# Altium project PP_2_0.PrjPcb
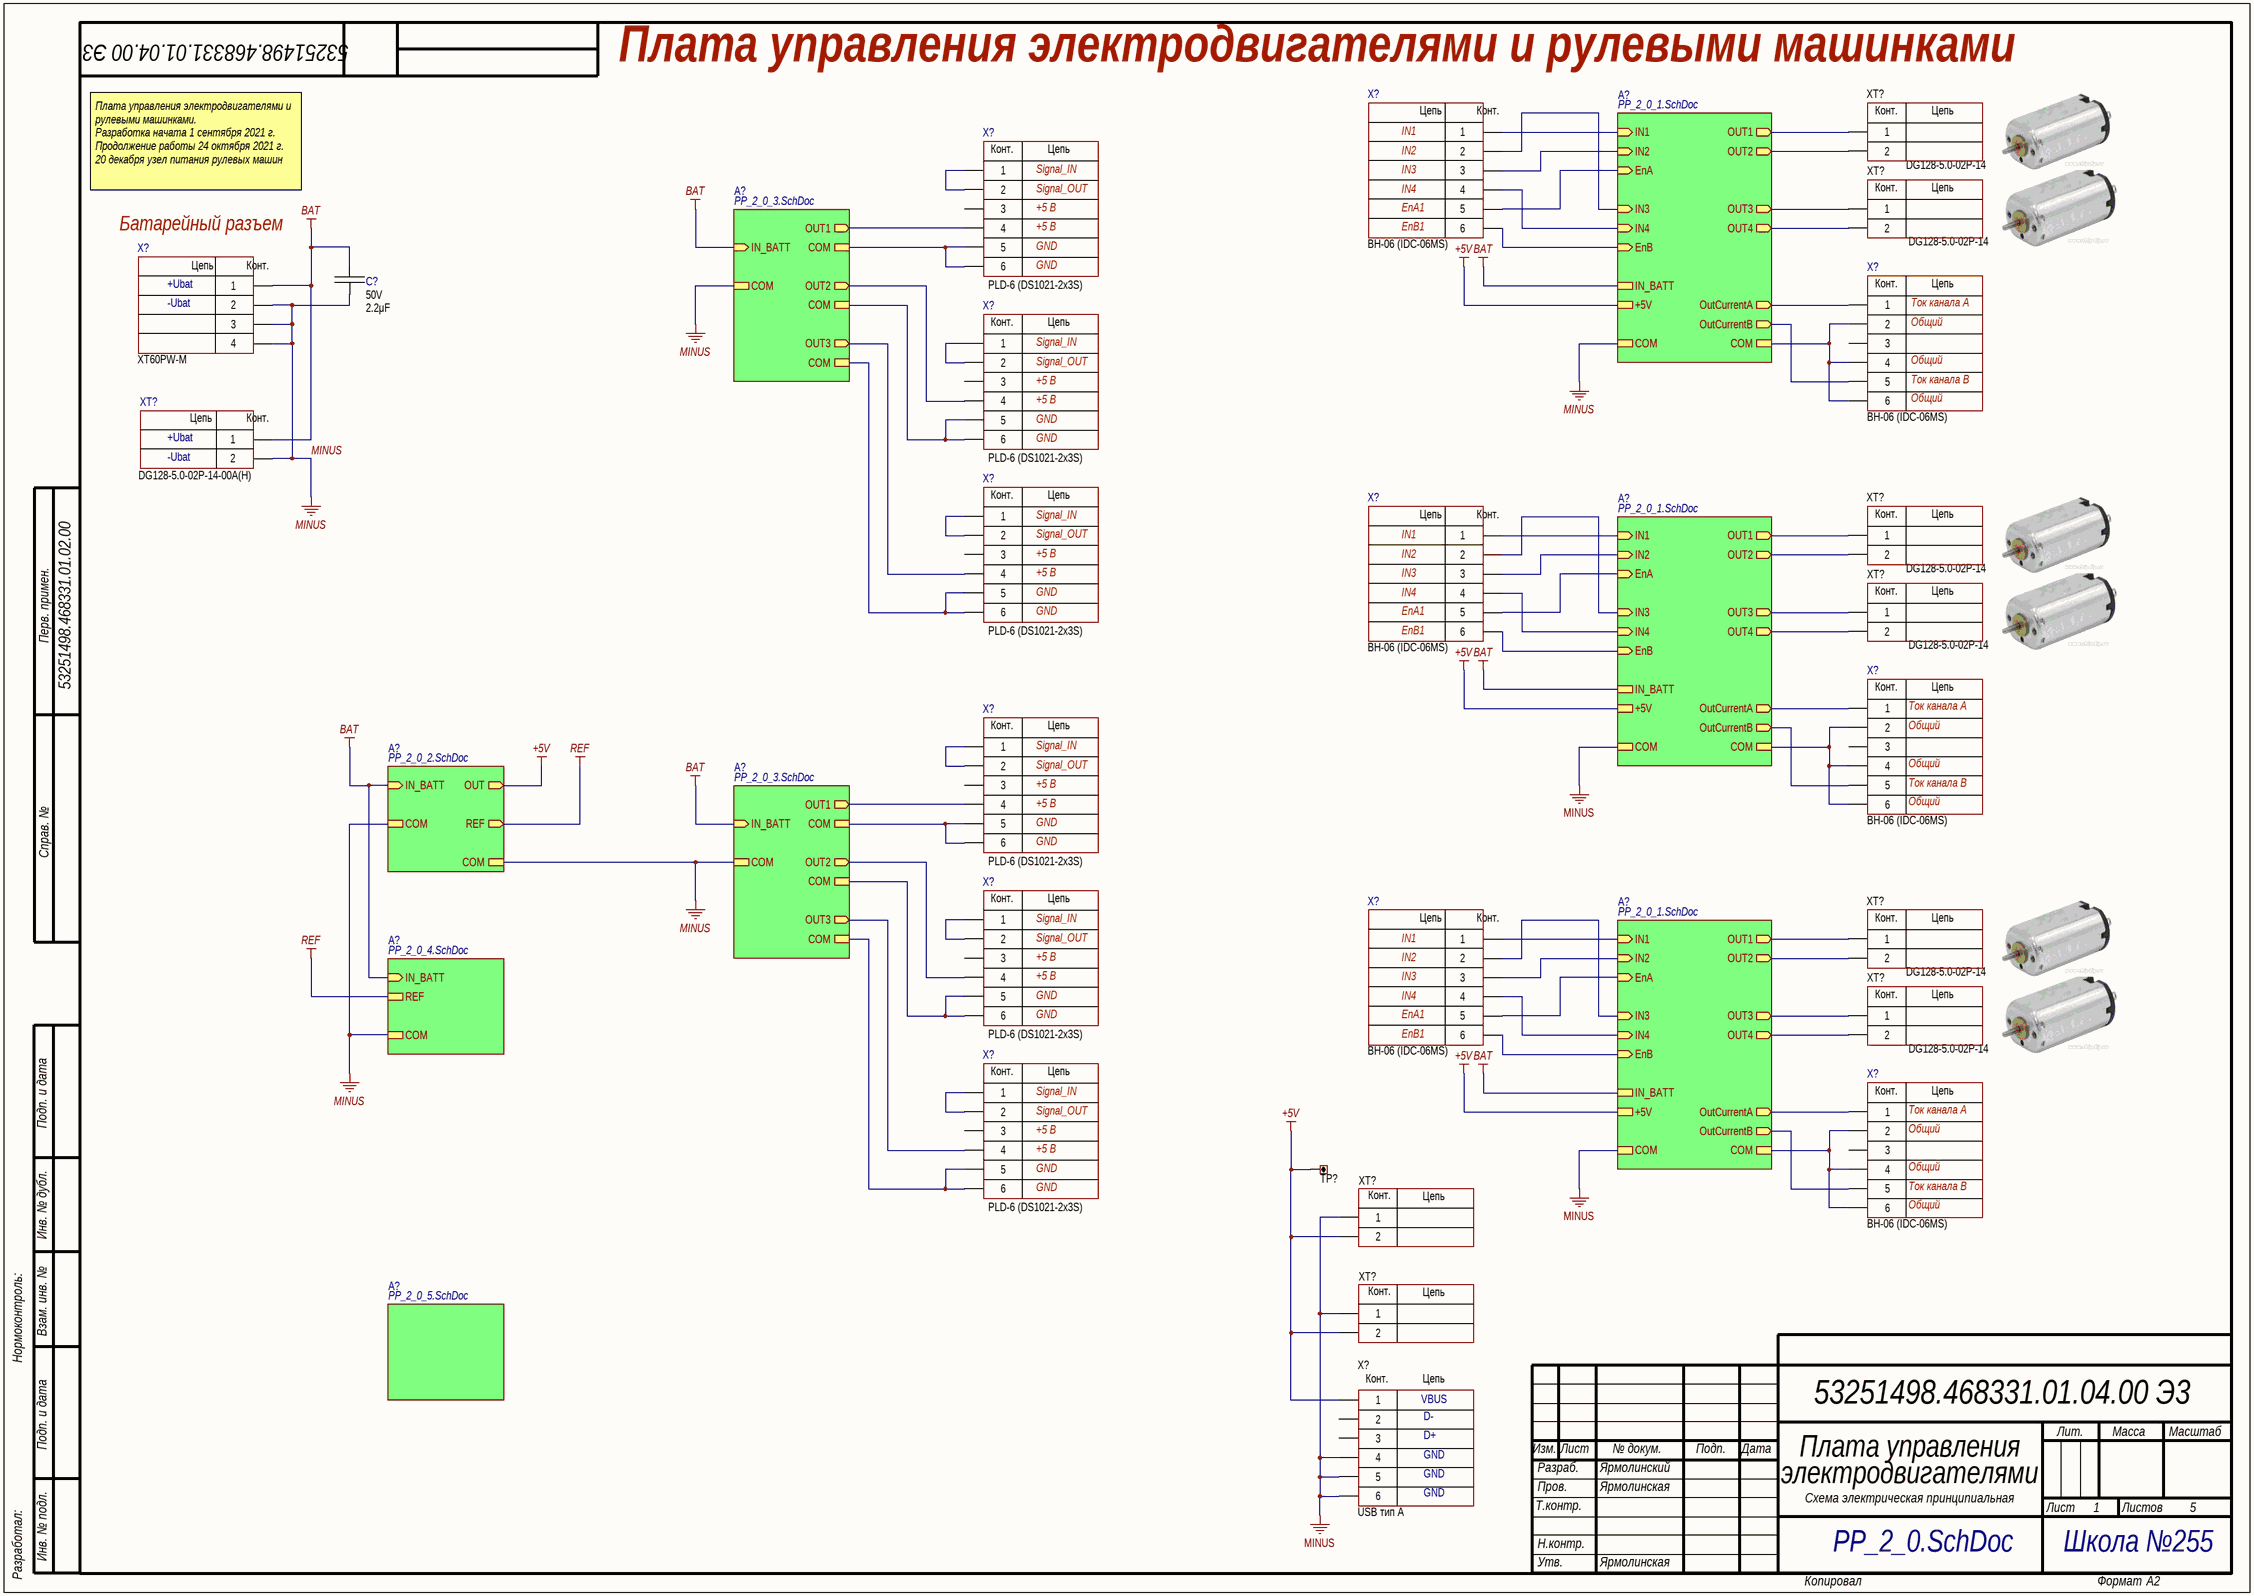
[diagram p0: PP_2_0.SchDoc]
6 sheets, 216 parts. Net scope: strictly hierarchical (ports join the sheet entries above them; power ports are local).
Sheets:
  PP_2_0.SchDoc
    A? = PP_2_0_1.SchDoc
    A? = PP_2_0_2.SchDoc
    A? = PP_2_0_3.SchDoc
    A? = PP_2_0_4.SchDoc
    A? = PP_2_0_3.SchDoc
    A? = PP_2_0_1.SchDoc
    A? = PP_2_0_1.SchDoc
    A? = PP_2_0_5.SchDoc

## Sheet PP_2_0.SchDoc: Плата управления
size 594 x 420 mm; ApprovedBy: Ярмолинская; CheckedBy: Ярмолинская; DrawnBy: Ярмолинский; Organization: Школа №255; DocumentNumber: 53251498.468331.01.04.00 Э3; SheetNumber: 1; SheetTotal: 5; Title1str: электродвигателями; DocumentType: Схема электрическая принципиальная; Format: A2; ImagePath: 53251498.468331.01.02.00

### Parts
(Parts that share a designator on the sheet are numbered #1, #2 ... from top to bottom, then left to right.)
C?#1  value 2.2μF  Voltage: 50V  [CAP: 1206, Thru-Hole]
TP?#1  (no value)  [CON: 5000 (Keystone)]
X?#1  CommentText: BH-06 (IDC-06MS)  [CON: IDC-6MS]
X?#2  CommentText: PLD-6 (DS1021-2x3S)  [CON: PLD-6]
X?#3  CommentText: XT60PW-M  [CON: XT60PW-M]
X?#4  CommentText: BH-06 (IDC-06MS)  [CON: IDC-6MS]
X?#5  CommentText: PLD-6 (DS1021-2x3S)  [CON: PLD-6]
X?#6  CommentText: PLD-6 (DS1021-2x3S)  [CON: PLD-6]
X?#7  CommentText: BH-06 (IDC-06MS)  [CON: IDC-6MS]
X?#8  CommentText: BH-06 (IDC-06MS)  [CON: IDC-6MS]
X?#9  CommentText: PLD-6 (DS1021-2x3S)  [CON: PLD-6]
X?#10  CommentText: PLD-6 (DS1021-2x3S)  [CON: PLD-6]
X?#11  CommentText: BH-06 (IDC-06MS)  [CON: IDC-6MS]
X?#12  CommentText: PLD-6 (DS1021-2x3S)  [CON: PLD-6]
X?#13  CommentText: BH-06 (IDC-06MS)  [CON: IDC-6MS]
X?#14  CommentText: USB тип А  [CON: 787761]
XT?#1  CommentText: DG128-5.0-02P-14  [CON: DG128-5.0-02P]
XT?#2  CommentText: DG128-5.0-02P-14  [CON: DG128-5.0-02P]
XT?#3  CommentText: DG128-5.0-02P-14-00A(H)  [CON: DG128-5.0-02P]
XT?#4  CommentText: DG128-5.0-02P-14  [CON: DG128-5.0-02P]
XT?#5  CommentText: DG128-5.0-02P-14  [CON: DG128-5.0-02P]
XT?#6  CommentText: DG128-5.0-02P-14  [CON: DG128-5.0-02P]
XT?#7  CommentText: DG128-5.0-02P-14  [CON: DG128-5.0-02P]
XT?#8  (no value)  [CON: DG128-5.0-02P]
XT?#9  (no value)  [CON: DG128-5.0-02P]

### Sub-sheets
A? = PP_2_0_1.SchDoc: OutCurrentB (out), IN3 (in), IN4 (in), EnB (in), OUT3 (out), OUT2 (out), OUT1 (out), OUT4 (out), IN2 (in), IN1 (in), EnA (in), OutCurrentA (out), IN_BATT, +5V, COM, COM
A? = PP_2_0_2.SchDoc: REF (out), COM, IN_BATT (in), COM, OUT (out)
A? = PP_2_0_3.SchDoc: OUT2 (out), IN_BATT (in), OUT3 (out), COM, OUT1 (out), COM, COM, COM
A? = PP_2_0_4.SchDoc: IN_BATT (in), COM, REF
A? = PP_2_0_3.SchDoc: OUT2 (out), IN_BATT (in), OUT3 (out), COM, OUT1 (out), COM, COM, COM
A? = PP_2_0_1.SchDoc: OutCurrentB (out), IN3 (in), IN4 (in), EnB (in), OUT3 (out), OUT2 (out), OUT1 (out), OUT4 (out), IN2 (in), IN1 (in), EnA (in), OutCurrentA (out), IN_BATT, +5V, COM, COM
A? = PP_2_0_1.SchDoc: OutCurrentB (out), IN3 (in), IN4 (in), EnB (in), OUT3 (out), OUT2 (out), OUT1 (out), OUT4 (out), IN2 (in), IN1 (in), EnA (in), OutCurrentA (out), IN_BATT, +5V, COM, COM
A? = PP_2_0_5.SchDoc: no entries

### Nets
+5V: TP?#1.1 X?#14.1 XT?#8.2 XT?#9.2 ; sheet A?/+5V, sheet A?/OUT, sheet A?/+5V, sheet A?/+5V
BAT: C?#1.2 X?#3.1 XT?#3.1 ; sheet A?/IN_BATT, sheet A?/IN_BATT, sheet A?/IN_BATT, sheet A?/IN_BATT, sheet A?/IN_BATT, sheet A?/IN_BATT, sheet A?/IN_BATT
MINUS: C?#1.1 X?#2.5 X?#2.6 X?#3.2 X?#3.3 X?#3.4 X?#4.2 X?#4.4 X?#4.6 X?#5.5 X?#5.6 X?#6.5 X?#6.6 X?#8.2 X?#8.4 X?#8.6 X?#9.5 X?#9.6 X?#10.5 X?#10.6 X?#12.5 X?#12.6 X?#13.2 X?#13.4 X?#13.6 X?#14.4 X?#14.5 X?#14.6 XT?#3.2 XT?#8.1 XT?#9.1 ; sheet A?/COM, sheet A?/COM, sheet A?/COM, sheet A?/COM, sheet A?/COM, sheet A?/COM, sheet A?/COM, sheet A?/COM, sheet A?/COM, sheet A?/COM, sheet A?/COM, sheet A?/COM, sheet A?/COM, sheet A?/COM, sheet A?/COM, sheet A?/COM, sheet A?/COM  [project net COM]
REF: sheet A?/REF, sheet A?/REF
OUT1: XT?#1.1 ; sheet A?/OUT1
OUT1: XT?#4.1 ; sheet A?/OUT1  [a separate net that carries the same name]
OUT1: XT?#6.1 ; sheet A?/OUT1  [a separate net that carries the same name]
OUT2: XT?#1.2 ; sheet A?/OUT2
OUT2: XT?#4.2 ; sheet A?/OUT2  [a separate net that carries the same name]
OUT2: XT?#6.2 ; sheet A?/OUT2  [a separate net that carries the same name]
OUT3: XT?#2.1 ; sheet A?/OUT3
OUT3: XT?#5.1 ; sheet A?/OUT3  [a separate net that carries the same name]
OUT3: XT?#7.1 ; sheet A?/OUT3  [a separate net that carries the same name]
OUT4: XT?#2.2 ; sheet A?/OUT4
OUT4: XT?#5.2 ; sheet A?/OUT4  [a separate net that carries the same name]
OUT4: XT?#7.2 ; sheet A?/OUT4  [a separate net that carries the same name]
OutCurrentA: X?#4.1 ; sheet A?/OutCurrentA
OutCurrentA: X?#8.1 ; sheet A?/OutCurrentA  [a separate net that carries the same name]
OutCurrentA: X?#13.1 ; sheet A?/OutCurrentA  [a separate net that carries the same name]
OutCurrentB: X?#4.5 ; sheet A?/OutCurrentB
OutCurrentB: X?#8.5 ; sheet A?/OutCurrentB  [a separate net that carries the same name]
OutCurrentB: X?#13.5 ; sheet A?/OutCurrentB  [a separate net that carries the same name]
NetDA?_A?#1_3: X?#1.5 ; sheet A?/EnA
NetDA?_A?#1_5: X?#1.1 ; sheet A?/IN1
NetDA?_A?#1_7: X?#1.3 ; sheet A?/IN2
NetDA?_A?#2_10: X?#1.2 ; sheet A?/IN3
NetDA?_A?#2_11: X?#1.6 ; sheet A?/EnB
NetDA?_A?#2_12: X?#1.4 ; sheet A?/IN4
NetDA?_A?#8_3: X?#7.5 ; sheet A?/EnA
NetDA?_A?#8_5: X?#7.1 ; sheet A?/IN1
NetDA?_A?#8_7: X?#7.3 ; sheet A?/IN2
NetDA?_A?#9_10: X?#7.2 ; sheet A?/IN3
NetDA?_A?#9_11: X?#7.6 ; sheet A?/EnB
NetDA?_A?#9_12: X?#7.4 ; sheet A?/IN4
NetDA?_A?#13_3: X?#11.5 ; sheet A?/EnA
NetDA?_A?#13_5: X?#11.1 ; sheet A?/IN1
NetDA?_A?#13_7: X?#11.3 ; sheet A?/IN2
NetDA?_A?#14_10: X?#11.2 ; sheet A?/IN3
NetDA?_A?#14_11: X?#11.6 ; sheet A?/EnB
NetDA?_A?#14_12: X?#11.4 ; sheet A?/IN4
NetF?_A?#2_2: X?#2.4 ; sheet A?/OUT1
NetF?_A?#3_2: X?#5.4 ; sheet A?/OUT2
NetF?_A?#4_2: X?#6.4 ; sheet A?/OUT3
NetF?_A?#5_2: X?#9.4 ; sheet A?/OUT1
NetF?_A?#6_2: X?#10.4 ; sheet A?/OUT2
NetF?_A?#7_2: X?#12.4 ; sheet A?/OUT3
NetX?#2_1: X?#2.1 X?#2.2
NetX?#5_1: X?#5.1 X?#5.2
NetX?#6_1: X?#6.1 X?#6.2
NetX?#9_1: X?#9.1 X?#9.2
NetX?#10_1: X?#10.1 X?#10.2
NetX?#12_1: X?#12.1 X?#12.2

Not connected (* = marked no-connect by the designer): X?#2 3; X?#4 3; X?#5 3; X?#6 3; X?#8 3; X?#9 3; X?#10 3; X?#12 3; X?#13 3; X?#14 2 3

### Notes on the sheet
- Плата управления электродвигателями и рулевыми машинками
- IN1
- IN2
- Плата управления электродвигателями и рулевыми машинками.
  Разработка начата 1 сентября 2021 г.
  Продолжение работы 24 октября 2021 г.
  20 декабря узел питания рулевых машин
- Signal_IN
- Signal_OUT
- +5 В
- EnA1
- IN3
- IN4
- Батарейный разъем
- GND
- EnB1
- +Ubat
- -Ubat
- Ток канала A
- Общий
- Ток канала B
- Перв. примен.
- Справ. №
- Подп. и дата
- Инв. № дубл.
- Нормоконтроль:
- Взам. инв. №
- Изм.
- Лист
- № докум.
- Подп.
- Дата
- Лит.
- Масса
- Масштаб
- Т.контр.
- Пров.
- Разраб.
- Листов
- Разработал:
- Инв. № подл.
- Н.контр.
- Утв.
- Копировал
- Формат
- (in symbol Connector_IDC_6pin) Цепь; Конт.
- (in symbol Connector_terminal_2pin) Конт.; Цепь
- (in symbol Connector_terminal_2pin DG128-5.0-02P) Цепь; Конт.
- (in symbol Connector_USB_4+2pin) Конт.; Цепь; VBUS; D-; D+; GND
- (in symbol Connector_XT60PW-M) Цепь; Конт.

### Library data of the parts
C?#1 = Ceramic_1210: К10-17Б имп. 2.2мкФ Y5V, +/-20%,1206; Manufacturer: Murata; PartNumber: CERCAP2.2/50V1206MY5V; ValueManufacturerPartNumber: Ceramic capacitor, 2.2μF, X7R, ±20%, 50V, 1210, -55...+125°C; TypeCapacitor: Ceramic capacitor; Tolerance: ±20%; TypeDielectric: X7R; Nom_Nom: 224600416; Package: 1210; HelpURL: https://www.digikey.com/product-detail/en/yageo/CC1210KKX7R9BB104/311-4522-1-ND/8025611; Temperature: -55...+125°C
TP?#1 = Connector_Test_Point: Manufacturer: Keystone; ValueManufacturerPartNumber: Test point, Keystone, 5001; PartNumber: 5001; TypeConnector: Test point; HelpURL: https://www.digikey.com/product-detail/en/keystone-electronics/5001/36-5001-ND/255327
X?#1 X?#4 X?#7 X?#8 X?#11 X?#13 = Connector_IDC_6pin: IDC, 6pin; Manufacturer: Connfly; ValueManufacturerPartNumber: IDC connector, 6pin, 2.54mm, 300VAC, 1A; PartNumber: DS1013-06SSiB1-B-0; TypeConnector: IDC connector; VoltageMax: 300VAC; Pitch: 2.54mm; CurrentMax: 1A; HelpURL: https://www.chipdip.ru/product/idc-06ms-bh-06; Multichannel: 6pin
X?#2 X?#5 X?#6 X?#9 X?#10 X?#12 = Connector_IDC_6pin: PLD-6 (DS1021-2x3S), Вилка штыревая 2.54мм 2x3 прямая тип1; Manufacturer: KLS; ValueManufacturerPartNumber: PLD connector, 6pin, 2.54mm, 300VAC, 1A; PartNumber: DS1021-2*3SF11-B; TypeConnector: PLD connector; VoltageMax: 300VAC; Pitch: 2.54mm; CurrentMax: 1A; Multichannel: 6pin; HelpURL: https://www.chipdip.ru/product/pld-6
X?#3 = Connector_XT60PW-M: Battery power; Manufacturer: AMASS; ValueManufacturerPartNumber: Battery power connector, 4pin, 5mm, 300VAC, 10A; TypeConnector: Battery power connector; VoltageMax: 300VAC; Pitch: 5mm; CurrentMax: 10A; Multichannel: 4pin; HelpURL: https://www.chipdip.ru/product0/8007758661; PartNumber: XT60PW-M
X?#14 = Connector_USB_4+2pin: USB разъем тип А; Manufacturer: TEConnectivity; PartNumber: USBA-1J; TypeConnector: USB type A connector; Multichannel: 4pin; HelpURL: https://www.chipdip.ru/product/292303-1-te; ValueManufacturerPartNumber: =TypeConnector+', '+Multichannel+', '+Pitch+', '+VoltageMax+', '+CurrentMax
XT?#1 XT?#2 XT?#4-XT?#7 = Connector_terminal_2pin DG128-5.0-02P: DG128-5.0-02P-14, Клеммник 2-контактный, 5мм, прямой; Manufacturer: Degson; ValueManufacturerPartNumber: Terminal connector, 2pin, 5mm, 300VAC, 10A; PartNumber: DG128-5.0-02P-14-00A(H); TypeConnector: Terminal connector; VoltageMax: 300VAC; Pitch: 5mm; CurrentMax: 10A; Multichannel: 2pin; HelpURL: https://www.chipdip.ru/product/dg128-5.0-02p-14
XT?#3 = Connector_terminal_2pin DG128-5.0-02P: DG128-5.0-02P-14, Клеммник 2-контактный, 5мм, прямой; Manufacturer: Degson; ValueManufacturerPartNumber: Terminal connector, 2pin, 5mm, 300VAC, 10A; TypeConnector: Terminal connector; VoltageMax: 300VAC; Pitch: 5mm; CurrentMax: 10A; Multichannel: 2pin; HelpURL: https://www.chipdip.ru/product/dg128-5.0-02p-14; PartNumber: DG128-5.0-02P-14-00A(H)
XT?#8 XT?#9 = Connector_terminal_2pin: Клеммник 2 клеммы; Manufacturer: Degson; ValueManufacturerPartNumber: Terminal connector, 4pin, 5mm, 300VAC, 10A; PartNumber: DG126-5.0-04P-14; TypeConnector: Terminal connector; VoltageMax: 300VAC; Pitch: 5mm; CurrentMax: 10A; Multichannel: 4pin; CommentText: "Разъем"; HelpURL: https://www.chipdip.ru/product/dg350-3.5-03p-12

## Sheet PP_2_0_1.SchDoc
size 209 x 297 mm; PageSetup: Record=PageOptions|CenterHorizontal=True|CenterVertical=True|PrintScale=0.94|XCorrection=1.00|YCorrection=1.00|PrintKind=2|BorderSize=5000000|LeftOffset=0|BottomOffset=0|Orientation=1|PaperLength=2970|PaperWidth=2100|Scale=100|PaperSource=7|PrintQuality=600|MediaType=1|DitherType=10|PaperKind=A4|PrintScaleMode=1; Title1str: (вторая строка при необходимости); DocumentType: Тип схемы; DocumentNumber: 53251498.468331.01.04.00 Э3; SheetNumber: 2; Format: A4
Used 3 times, as channels A?, A?, A?. Parts and nets are listed once, with the designators drawn on the sheet.
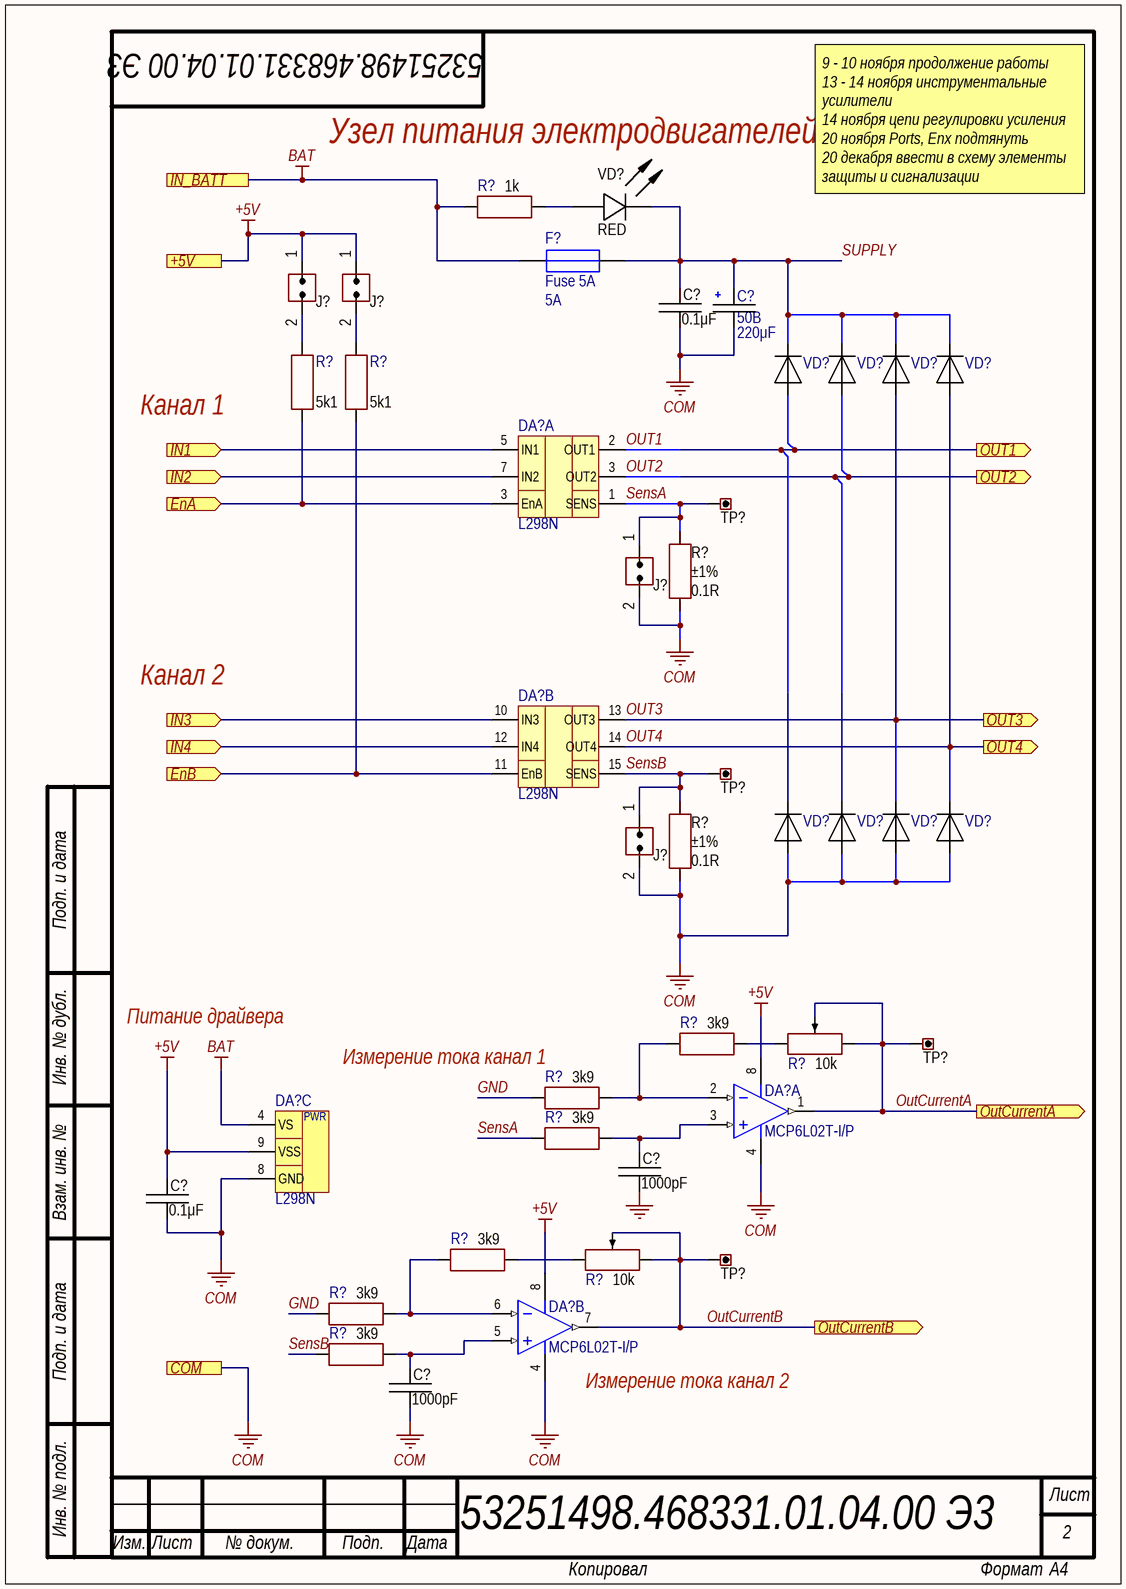
[diagram p1: PP_2_0_1.SchDoc]

### Parts
(Parts that share a designator on the sheet are numbered #1, #2 ... from top to bottom, then left to right.)
C?#1  value 0.1μF  [CAP: 0805, Thru-Hole]
C?#2  value 220μF  Voltage: 50В  [CAP: RB2-5]  (hidden comment: Cap Pol1)
C?#3  value 1000pF  [CAP: 0805, Thru-Hole]
C?#4  value 0.1μF  [CAP: 0805, Thru-Hole]
C?#5  value 1000pF  [CAP: 0805, Thru-Hole]
DA?#1  L298N  [Multivatt15]  (part A of 3)
DA?#2  L298N  [Multivatt15]  (part B of 3)
DA?#3  MCP6L02T-I/P  [DIP-8]  (part A of 2)
DA?#4  L298N  [Multivatt15]  (part C of 3)
DA?#5  MCP6L02T-I/P  [DIP-8]  (part B of 2)
F?  Fuse 5A  value 5A  [FUSE:MF-R_Style_2]
J?#1  (no value)  [CON: PLS-2]
J?#2  (no value)  [CON: PLS-2]
J?#3  (no value)  [CON: PLS-2]
J?#4  (no value)  [CON: PLS-2]
R?#1  value 1k  [RES:CF-1/4W]
R?#2  value 5k1  [RES:CF-1/4W]
R?#3  value 5k1  [RES:CF-1/4W]
R?#4  value 0.1R  Tolerance: ±1%  [RES:CF-1/1W]
R?#5  value 0.1R  Tolerance: ±1%  [RES:CF-1/1W]
R?#6  value 3k9  [RES:CF-1/4W]
R?#7  value 10k  [RES: 3296W]
R?#8  value 3k9  [RES:CF-1/4W]
R?#9  value 3k9  [RES:CF-1/4W]
R?#10  value 3k9  [RES:CF-1/4W]
R?#11  value 10k  [RES: 3296W]
R?#12  value 3k9  [RES:CF-1/4W]
R?#13  value 3k9  [RES:CF-1/4W]
TP?#1  (no value)  [CON: 5000 (Keystone)]
TP?#2  (no value)  [CON: 5000 (Keystone)]
TP?#3  (no value)  [CON: 5000 (Keystone)]
TP?#4  (no value)  [CON: 5000 (Keystone)]
VD?#1  Color: RED  [LED: 3MM_301_R]
VD?#2  (no value)  [DIODE: DO-41]
VD?#3  (no value)  [DIODE: DO-41]
VD?#4  (no value)  [DIODE: DO-41]
VD?#5  (no value)  [DIODE: DO-41]
VD?#6  (no value)  [DIODE: DO-41]
VD?#7  (no value)  [DIODE: DO-41]
VD?#8  (no value)  [DIODE: DO-41]
VD?#9  (no value)  [DIODE: DO-41]

### Ports
+5V, COM, EnA (in), EnB (in), IN1 (in), IN2 (in), IN3 (in), IN4 (in), IN_BATT, OUT1 (out), OUT2 (out), OUT3 (out), OUT4 (out), OutCurrentA (out), OutCurrentB (out)

### Nets
+5V: C?#4.2 DA?#3.8(VDD) DA?#4.9(VSS) DA?#5.8(VDD) J?#1.1(IN) J?#2.1(IN) ; port +5V
BAT: DA?#4.4(VS) F?.1 R?#1.1 ; port IN_BATT
COM: C?#1.1 C?#2.1 C?#3.1 C?#4.1 C?#5.1 DA?#3.4(VSS) DA?#4.8(GND) DA?#5.4(VSS) J?#3.2(IN) J?#4.2(IN) R?#4.1 R?#5.1 VD?#6.1 VD?#7.1 VD?#8.1 VD?#9.1 ; port COM
EnA: DA?#1.3(EnA) R?#2.1 ; port EnA
EnB: DA?#2.11(EnB) R?#3.1 ; port EnB
GND: R?#8.1 R?#12.1
IN1: DA?#1.5(IN1) ; port IN1
IN2: DA?#1.7(IN2) ; port IN2
IN3: DA?#2.10(IN3) ; port IN3
IN4: DA?#2.12(IN4) ; port IN4
OUT1: DA?#1.2(OUT1) VD?#2.1 VD?#6.2 ; port OUT1
OUT2: DA?#1.3(OUT2) VD?#3.1 VD?#7.2 ; port OUT2
OUT3: DA?#2.13(OUT3) VD?#4.1 VD?#8.2 ; port OUT3
OUT4: DA?#2.14(OUT4) VD?#5.1 VD?#9.2 ; port OUT4
OutCurrentA: DA?#3.1(VOUTA) R?#7.2 R?#7.3 TP?#3.1 ; port OutCurrentA
OutCurrentB: DA?#5.7(VOUTB) R?#11.2 R?#11.3 TP?#4.1 ; port OutCurrentB
SensA: DA?#1.1(SENS) J?#3.1(IN) R?#4.2 R?#9.1 TP?#1.1
SensB: DA?#2.15(SENS) J?#4.1(IN) R?#5.2 R?#13.1 TP?#2.1
SUPPLY: C?#1.2 C?#2.2 F?.2 VD?#1.2(C) VD?#2.2 VD?#3.2 VD?#4.2 VD?#5.2
NetC?#3_2: C?#3.2 DA?#3.3(VINA+) R?#9.2
NetC?#5_2: C?#5.2 DA?#5.5(VINB+) R?#13.2
NetDA?#3_2: DA?#3.2(VINA-) R?#6.1 R?#8.2
NetDA?#5_6: DA?#5.6(VINB-) R?#10.1 R?#12.2
NetJ?#1_2: J?#1.2(IN) R?#2.2
NetJ?#2_2: J?#2.2(IN) R?#3.2
NetR?#1_2: R?#1.2 VD?#1.1(A)
NetR?#6_2: R?#6.2 R?#7.1
NetR?#10_2: R?#10.2 R?#11.1

### Channels
A?: designators C?=C?_A?#1 C?=C?_A?#2 C?=C?_A?#4 C?=C?_A?#3 C?=C?_A?#5 DA?=DA?_A?#1 DA?=DA?_A?#2 DA?=DA?_A?#4 DA?=DA?_A?#3 DA?=DA?_A?#5 F?=F?_A?#1 J?=J?_A?#3 J?=J?_A?#4 J?=J?_A?#1 J?=J?_A?#2 R?=R?_A?#4 R?=R?_A?#5 R?=R?_A?#8 R?=R?_A?#9 R?=R?_A?#12 R?=R?_A?#13 R?=R?_A?#6 R?=R?_A?#7 R?=R?_A?#10 R?=R?_A?#11 R?=R?_A?#2 R?=R?_A?#3 R?=R?_A?#1 TP?=TP?_A?#1 TP?=TP?_A?#2 TP?=TP?_A?#3 TP?=TP?_A?#4 VD?=VD?_A?#2 VD?=VD?_A?#3 VD?=VD?_A?#4 VD?=VD?_A?#5 VD?=VD?_A?#6 VD?=VD?_A?#7 VD?=VD?_A?#8 VD?=VD?_A?#9 VD?=VD?_A?#1; ports +5V=+5V COM=COM EnA=NetDA?_A?#1_3 EnB=NetDA?_A?#2_11 IN1=NetDA?_A?#1_5 IN2=NetDA?_A?#1_7 IN3=NetDA?_A?#2_10 IN4=NetDA?_A?#2_12 IN_BATT=BAT OUT1=OUT1 OUT2=OUT2 OUT3=OUT3 OUT4=OUT4 OutCurrentA=OutCurrentA OutCurrentB=OutCurrentB
A?: designators C?=C?_A?#18 C?=C?_A?#19 C?=C?_A?#21 C?=C?_A?#20 C?=C?_A?#22 DA?=DA?_A?#8 DA?=DA?_A?#9 DA?=DA?_A?#11 DA?=DA?_A?#10 DA?=DA?_A?#12 F?=F?_A?#8 J?=J?_A?#7 J?=J?_A?#8 J?=J?_A?#5 J?=J?_A?#6 R?=R?_A?#23 R?=R?_A?#24 R?=R?_A?#27 R?=R?_A?#28 R?=R?_A?#31 R?=R?_A?#32 R?=R?_A?#25 R?=R?_A?#26 R?=R?_A?#29 R?=R?_A?#30 R?=R?_A?#21 R?=R?_A?#22 R?=R?_A?#20 TP?=TP?_A?#7 TP?=TP?_A?#8 TP?=TP?_A?#9 TP?=TP?_A?#10 VD?=VD?_A?#17 VD?=VD?_A?#18 VD?=VD?_A?#19 VD?=VD?_A?#20 VD?=VD?_A?#21 VD?=VD?_A?#22 VD?=VD?_A?#23 VD?=VD?_A?#24 VD?=VD?_A?#16; ports +5V=+5V COM=COM EnA=NetDA?_A?#8_3 EnB=NetDA?_A?#9_11 IN1=NetDA?_A?#8_5 IN2=NetDA?_A?#8_7 IN3=NetDA?_A?#9_10 IN4=NetDA?_A?#9_12 IN_BATT=BAT OUT1=OUT1 OUT2=OUT2 OUT3=OUT3 OUT4=OUT4 OutCurrentA=OutCurrentA OutCurrentB=OutCurrentB
A?: designators C?=C?_A?#23 C?=C?_A?#24 C?=C?_A?#26 C?=C?_A?#25 C?=C?_A?#27 DA?=DA?_A?#13 DA?=DA?_A?#14 DA?=DA?_A?#16 DA?=DA?_A?#15 DA?=DA?_A?#17 F?=F?_A?#9 J?=J?_A?#11 J?=J?_A?#12 J?=J?_A?#9 J?=J?_A?#10 R?=R?_A?#36 R?=R?_A?#37 R?=R?_A?#40 R?=R?_A?#41 R?=R?_A?#44 R?=R?_A?#45 R?=R?_A?#38 R?=R?_A?#39 R?=R?_A?#42 R?=R?_A?#43 R?=R?_A?#34 R?=R?_A?#35 R?=R?_A?#33 TP?=TP?_A?#11 TP?=TP?_A?#12 TP?=TP?_A?#13 TP?=TP?_A?#14 VD?=VD?_A?#26 VD?=VD?_A?#27 VD?=VD?_A?#28 VD?=VD?_A?#29 VD?=VD?_A?#30 VD?=VD?_A?#31 VD?=VD?_A?#32 VD?=VD?_A?#33 VD?=VD?_A?#25; ports +5V=+5V COM=COM EnA=NetDA?_A?#13_3 EnB=NetDA?_A?#14_11 IN1=NetDA?_A?#13_5 IN2=NetDA?_A?#13_7 IN3=NetDA?_A?#14_10 IN4=NetDA?_A?#14_12 IN_BATT=BAT OUT1=OUT1 OUT2=OUT2 OUT3=OUT3 OUT4=OUT4 OutCurrentA=OutCurrentA OutCurrentB=OutCurrentB

### Notes on the sheet
- Узел питания электродвигателей
- 9 - 10 ноября продолжение работы
  13 - 14 ноября инструментальные усилители
  14 ноября цепи регулировки усиления
  20 ноября Ports, Enx подтянуть
  20 декабря ввести в схему элементы защиты и сигнализации
- Канал 1
- Канал 2
- Питание драйвера
- (near R?#8) Измерение тока канал 1
- (near DA?#5) Измерение тока канал 2
- Подп. и дата
- Инв. № дубл.
- Взам. инв. №
- Инв. № подл.
- Лист
- Изм.
- № докум.
- Подп.
- Дата
- Копировал
- Формат
- (in symbol L298N, part C) PWR

### Library data of the parts
C?#1 C?#4 = Ceramic_0805: К10-17 0805; Manufacturer: Murata; PartNumber: RPEE41H105M3M1C05A; ValueManufacturerPartNumber: Ceramic capacitor, 0.1μF, X7R, ±10%, 50V, 1206, -55...+125°C; TypeCapacitor: Ceramic capacitor; Tolerance: ±10%; TypeDielectric: X7R; Voltage: 50V; Package: 1206; HelpURL: https://www.chipdip.ru/product/rpee41h105m3; Temperature: -55...+125°C
C?#2 = Cap Pol1: ECAP (К50-35), 220мкФ, 50В, 105°C, 20%, 10x12мм P:5мм; Partnumber: JRB1H221M05001000120000B; Pitch: 5mm; Published: 8-Jun-2000; LatestRevisionDate: 17-Jul-2002; LatestRevisionNote: Re-released for DXP Platform.; PackageReference: RB5-10; Publisher: Altium Limited; PackageDescription: Polarized Capacitor (Radial); 2 Leads
C?#3 C?#5 = Ceramic_0805: К10-17Б имп. 1000пФ X7R,10%,0805, Конденсатор керамический выводной; Manufacturer: Murata; PartNumber: RPEE41H105M3M1C05A; ValueManufacturerPartNumber: Ceramic capacitor, 1000pF, X7R, ±10%, 50V, 0805, -55...+125°C; TypeCapacitor: Ceramic capacitor; Voltage: 50V; Package: 0805; HelpURL: https://www.chipdip.ru/product/rpee41h105m3; Temperature: -55...+125°C; Tolerance: ±10%; TypeDielectric: X7R
DA?#1 DA?#2 DA?#4 = L298N: L298N, Двойной полномостовой драйвер [Multiwatt-15, Vertical]
DA?#3 DA?#5 = MCP6L02T-I/P: MCP602-I/P, 2-х канальный ОУ с однополярным питанием, 2.7В…5.5В, [DIP-8]; Published: 2-Dec-2009; DatasheetVersion: revA, Mar-2009; PackageVersion: revBB, Aug-2009; PackageReference: DIP-8; Publisher: Altium Limited; PackageDescription: 8-Lead Plastic Small Outline (SN) - Narrow, 3.90mm Body [SOIC]; Supplier 1: Digi-Keyhttps://www.chipdip.ru/product/mcp602-i-p; Supplier Part Number 1: MCP602-I/P; Supplier 2: Digi-Key; Supplier Part Number 2: MCP6L02T-E/SNCT-ND; Supplier 3: Digi-Key; Supplier Part Number 3: MCP6L02T-E/SNDKR-ND; Supplier 4: Farnell; Supplier Part Number 4: 1715882; Code_JEDEC: MS-012; Code_IPC: SOIC127P600-8; ComponentLink1Description: Datasheet; ComponentLink1URL: http://ww1.microchip.com/downloads/en/DeviceDoc/22140a.pdf; ComponentLink2Description: Packaging Specification; ComponentLink2URL: http://www.microchip.com/stellent/groups/techpub_sg/documents/packagingspec/en012702.pdf; ComponentLink3Description: Microchip.com Home; ComponentLink3URL: http://www.microchip.com/
J?#1-J?#4 = Jumper_single: CommentText: "Перемычка"
R?#1 = Resistor_CF-25: MF-25 (С2-23) 0.25 Вт, 1кОм, 5%, Резистор металлопленочный; Manufacturer: Yageo; PartNumber: CF-1/4W-1KJ; ValueManufacturerPartNumber: Resistor film, 1k, ±5%, CF-25, 0.25W, -55...+125°C; TypeResistor: Resistor film; Power: 0.25W; Package: CF-25; HelpURL: https://www.chipdip.ru/product0/44435; Temperature: -55...+125°C; Tolerance: ±5%
R?#2 R?#3 = Resistor_CF-25: CF-25 (С1-4) 0.25 Вт, 5.1 кОм, 5%, Резистор углеродистый; Manufacturer: Yageo; PartNumber: CF-1/4W-5K1J; ValueManufacturerPartNumber: Resistor film, 5k1, ±5%, CF-25, 0.25W, -55...+125°C; TypeResistor: Resistor film; Power: 0.25W; Package: CF-25; HelpURL: https://www.chipdip.ru/product0/57331; Temperature: -55...+125°C; Tolerance: ±5%
R?#4 R?#5 = Resistor_CF-100: KNP-100 1 Вт, 0.1 Ом, 5%, Резистор проволочный; Manufacturer: Yageo; PartNumber: KNP-1W-0R1J; ValueManufacturerPartNumber: Resistor film, 0.1R, ±1%, CF-100, 1W, -55...+125°C; TypeResistor: Resistor film; Power: 1W; Package: CF-100; HelpURL: https://www.digikey.com/product-detail/en/yageo/RC0201JR-07100RL/311-100NCT-ND/1949006; Temperature: -55...+125°C
R?#6 R?#8-R?#10 R?#12 R?#13 = Resistor_CF-25: MF-25 (С2-23) 0.25 Вт, 3.9 кОм, 1%, Резистор металлопленочный; Manufacturer: Yageo; PartNumber: MF-1/4W-3K9F; ValueManufacturerPartNumber: Resistor film, 3k9, ±1%, CF-25, 0.25W, -55...+125°C; TypeResistor: Resistor film; Power: 0.25W; Package: CF-25; HelpURL: https://www.chipdip.ru/product0/57331; Temperature: -55...+125°C; Tolerance: ±1%
R?#7 R?#11 = Trimmer: Manufacturer: Bourns; PartNumber: 3296W-1-103LF; ValueManufacturerPartNumber: Resistor film, 10k, ±10%, 3296W, 0.5W, -55...+125°C; TypeResistor: Resistor film; Power: 0.5W; Tolerance: ±10%; Package: 3296W; HelpURL: https://www.digikey.com/product-detail/en/bourns-inc/3296W-1-103LF/3296W-103LF-ND/1088045; Temperature: -55...+125°C
TP?#1-TP?#4 = Connector_Test_Point: as TP?#1 on sheet PP_2_0; HelpURL: https://www.digikey.com/product-detail/en/keystone-electronics/5001/36-5001-ND/255327
VD?#1 = LED_single: ValueManufacturerPartNumber: LED, RED, *, *, *, -55...+150°C; PartNumber: L-1503CB/1ID; TypeDiode: LED; Manufacturer: *; Package: *; HelpURL: *; Temperature: -55...+150°C; Current: *; VoltageDrop: *; ColorParameter: RED
VD?#2-VD?#9 = 1N4007: Manufacturer: Micro Commercial; ValueManufacturerPartNumber: Single diode, 1000V, 1A, 1V, 4ns, DO-41, -55...+150°C; TypeDiode: Single diode; Voltage: 1000V; Current: 1A; VoltageDrop: 1V; RecoveryTime: 4ns; Package: DO-41; HelpURL: https://www.chipdip.ru/product/1n4007; Temperature: -55...+150°C; PartNumber: 1N4007
F? = Fuse 5A: Published: 8-Jun-2000; LatestRevisionDate: 17-Jul-2002; LatestRevisionNote: Re-released for DXP Platform.; PackageReference: PIN-W2/E2.8; Publisher: Altium Limited; PackageDescription: Thru-Hole; 2 Leads

## Sheet PP_2_0_2.SchDoc
size 209 x 297 mm; PageSetup: Record=PageOptions|CenterHorizontal=True|CenterVertical=True|PrintScale=0.94|XCorrection=1.00|YCorrection=1.00|PrintKind=2|BorderSize=5000000|LeftOffset=0|BottomOffset=0|Orientation=1|PaperLength=2970|PaperWidth=2100|Scale=100|PaperSource=7|PrintQuality=600|MediaType=1|DitherType=10|PaperKind=A4|PrintScaleMode=1; Title1str: (вторая строка при необходимости); DocumentType: Тип схемы; DocumentNumber: 53251498.468331.01.04.00 Э3; SheetNumber: 3; Format: A4
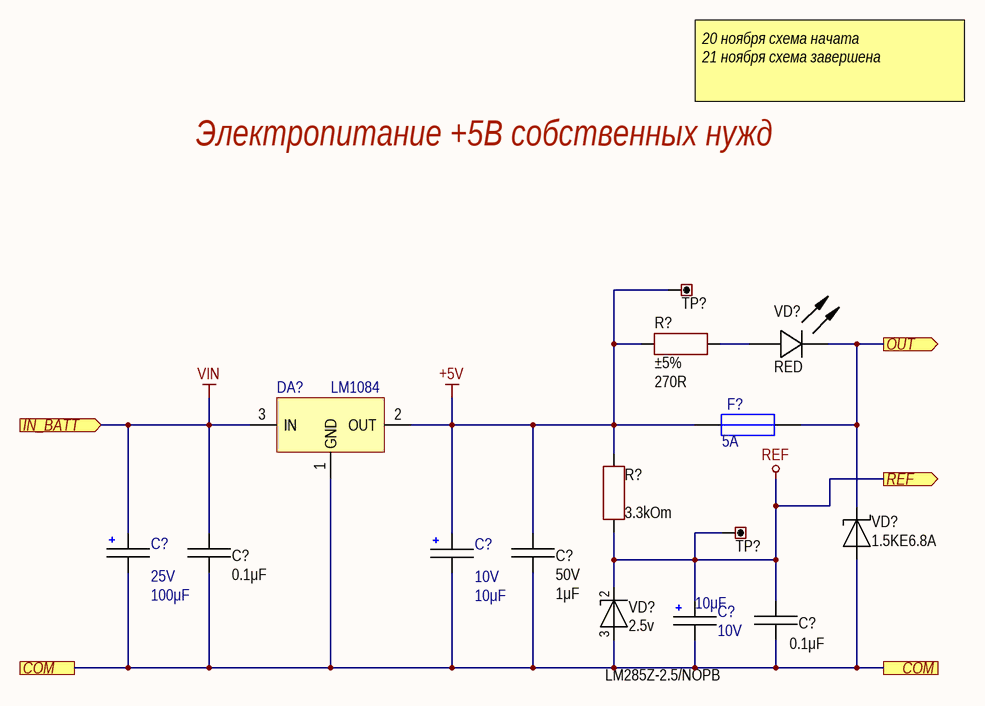
[diagram p2: PP_2_0_2.SchDoc]

### Parts
(Parts that share a designator on the sheet are numbered #1, #2 ... from top to bottom, then left to right.)
C?#2  value 100μF  Voltage: 25V  [CAP: RB2-5]  (hidden comment: Cap Pol1)
C?#3  value 0.1μF  [CAP: 0805, Thru-Hole]
C?#4  value 10μF  Voltage: 10V  [CAP: RB2-5]  (hidden comment: Cap Pol1)
C?#5  value 1μF  Voltage: 50V  [CAP: 1206, Thru-Hole]
C?#6  value 10μF  Voltage: 10V  [CAP: RB2-5]  (hidden comment: Cap Pol1)
C?#7  value 0.1μF  [CAP: 0805, Thru-Hole]
DA?#1  7805  [TO-220_heatsink]  (value not drawn)
F?  CurrentValue: 5A  [MF-R_Style_2]  (hidden comment: Fuse 5A)
R?#1  value 270R  Tolerance: ±5%  [AXIAL-0.3]
R?#2  value 3.3kOm  [AXIAL-0.3]
TP?#2  (no value)  [CON: 5000 (Keystone)]
TP?#3  (no value)  [CON: 5000 (Keystone)]
VD?#1  Color: RED  [LED: 3MM_301_R]
VD?#2  PartNumber: 1.5KE6.8А  [DIODE: DO-201AD]
VD?#3  Voltage: 2.5v  PartNumber: LM285Z-2.5/NOPB  [TO-92A-1]

### Ports
COM, IN_BATT (in), OUT (out), REF (out)

### Nets
+5V: F?.2 VD?#1.2(C) VD?#2.2 ; port OUT
+5V: C?#4.2 C?#5.2 DA?#1.2(OUT) F?.1 R?#1.1 R?#2.2 TP?#2.1  [a separate net that carries the same name]
COM: C?#3.1 C?#4.1 C?#5.1 C?#6.1 C?#7.2 DA?#1.1(GND) VD?#2.1 VD?#3.3(A) ; port COM
REF: C?#6.2 C?#7.1 R?#2.1 TP?#3.1 VD?#3.2(C) ; port REF
VIN: C?#2.2 C?#3.2 DA?#1.3(IN) ; port IN_BATT  [project net BAT]
NetR?#1_2: R?#1.2 VD?#1.1(A)

Not connected (* = marked no-connect by the designer): C?#2 1

### Notes on the sheet
- 20 ноября схема начата
  21 ноября схема завершена
- Электропитание +5В собственных нужд
- Подп. и дата
- Инв. № дубл.
- Взам. инв. №
- Инв. № подл.
- Лист
- Изм.
- № докум.
- Подп.
- Дата
- Копировал
- Формат

### Library data of the parts
C?#2 C?#4 C?#6 = Cap Pol1: Polarized Capacitor (Radial); Published: 8-Jun-2000; LatestRevisionDate: 17-Jul-2002; LatestRevisionNote: Re-released for DXP Platform.; PackageReference: RB2-5; Publisher: Altium Limited; PackageDescription: Polarized Capacitor (Radial); 2 Leads
C?#3 C?#7 = Ceramic_0805: as C?#1 on sheet PP_2_0_1; Package: 1206; HelpURL: https://www.chipdip.ru/product/rpee41h105m3; Temperature: -55...+125°C
C?#5 = Ceramic_1206: К10-17 1206; Manufacturer: Murata; PartNumber: RPEE41H105M3M1C05A; ValueManufacturerPartNumber: Ceramic capacitor, 1μF, X7R, ±10%, 50V, 1206, -55...+125°C; TypeCapacitor: Ceramic capacitor; Tolerance: ±10%; TypeDielectric: X7R; Package: 1206; HelpURL: https://www.chipdip.ru/product/rpee41h105m3; Temperature: -55...+125°C
DA?#1 = LM1084: 3-Terminal 5V 5-Amp Low-Dropout, Positive Regulator; Note: Pin 2 is electrically connected to tab; Published: 15-Apr-2002; DatasheetVersion: Feb-1988; PackageVersion: Sep-1995; PackageReference: KC03; Publisher: Altium Limited; PackageDescription: TO220, Thru-Hole, Vertical, Heatsink Mounted; 3 In-Line Leads; Pitch 2.54 mm; ComponentLink1Description: Manufacturer Link; ComponentLink1URL: http://www.ti.com/; Type: LM1084
F? = Fuse 5A: PartNumber: MF-R300; Published: 8-Jun-2000; LatestRevisionDate: 17-Jul-2002; LatestRevisionNote: Re-released for DXP Platform.; PackageReference: PIN-W2/E2.8; Publisher: Altium Limited; PackageDescription: Thru-Hole; 2 Leads
R?#1 = ResistorCF-25: Manufacturer: Yageo; PartNumber: СF-1/4W-100RF; ValueManufacturerPartNumber: Resistor film, 270R, ±5%, CF-25, 0.25W, -55...+125°C; TypeResistor: Resistor film; Power: 0.25W; Package: CF-25; HelpURL: https://www.digikey.com/product-detail/en/yageo/RC0201JR-07100RL/311-100NCT-ND/1949006; Temperature: -55...+125°C
R?#2 = ResistorCF-25: Manufacturer: Yageo; PartNumber: СF-1/4W-100RF; ValueManufacturerPartNumber: Resistor film, 3.3kOm, ±5%, CF-25, 0.25W, -55...+125°C; TypeResistor: Resistor film; Power: 0.25W; Tolerance: ±5%; Package: CF-25; HelpURL: https://www.digikey.com/product-detail/en/yageo/RC0201JR-07100RL/311-100NCT-ND/1949006; Temperature: -55...+125°C
TP?#2 TP?#3 = Connector_Test_Point: as TP?#1 on sheet PP_2_0; HelpURL: https://www.digikey.com/product-detail/en/keystone-electronics/5001/36-5001-ND/255327
VD?#1 = LED_single: as VD?#1 on sheet PP_2_0_1; Manufacturer: *; Package: *; HelpURL: *; Temperature: -55...+150°C; Current: *; VoltageDrop: *; ColorParameter: RED
VD?#2 = Schottky_supressor: Manufacturer: ST; ValueManufacturerPartNumber: Schottky supressor, 6.8V, 5A, 1V, 15pF, DO-201AE, -55...+150°C; TypeDiode: Schottky supressor; Current: 5A; VoltageDrop: 1V; RecoveryTime: 15pF; Voltage: 6.8V; Package: DO-201AE; HelpURL: https://www.chipdip.ru/product/1.5ke6.8a; Temperature: -55...+150°C
VD?#3 = LM285: Voltage reference LM285/385; Manufacturer: Diodes Incorporated; ValueManufacturerPartNumber: Zener diode, 2.5v, 500mW, 0.9V, 17Ohm, TO-92, -55...+150°C; TypeDiode: Zener diode; Current: 500mW; VoltageDrop: 0.9V; RecoveryTime: 17Ohm; Package: TO-92; HelpURL: https://www.digikey.com/product-detail/en/diodes-incorporated/MMSZ5231B-7-F/MMSZ5231B-FDICT-ND/755506; Temperature: -55...+150°C

## Sheet PP_2_0_3.SchDoc
size 209 x 297 mm; PageSetup: Record=PageOptions|CenterHorizontal=True|CenterVertical=True|PrintScale=0.94|XCorrection=1.00|YCorrection=1.00|PrintKind=2|BorderSize=5000000|LeftOffset=0|BottomOffset=0|Orientation=1|PaperLength=2970|PaperWidth=2100|Scale=100|PaperSource=7|PrintQuality=600|MediaType=1|DitherType=10|PaperKind=A4|PrintScaleMode=1; Title1str: (вторая строка при необходимости); DocumentType: Тип схемы; DocumentNumber: 53251498.468331.01.04.00 Э3; SheetNumber: 4; Format: A4
Used 2 times, as channels A?, A?. Parts and nets are listed once, with the designators drawn on the sheet.
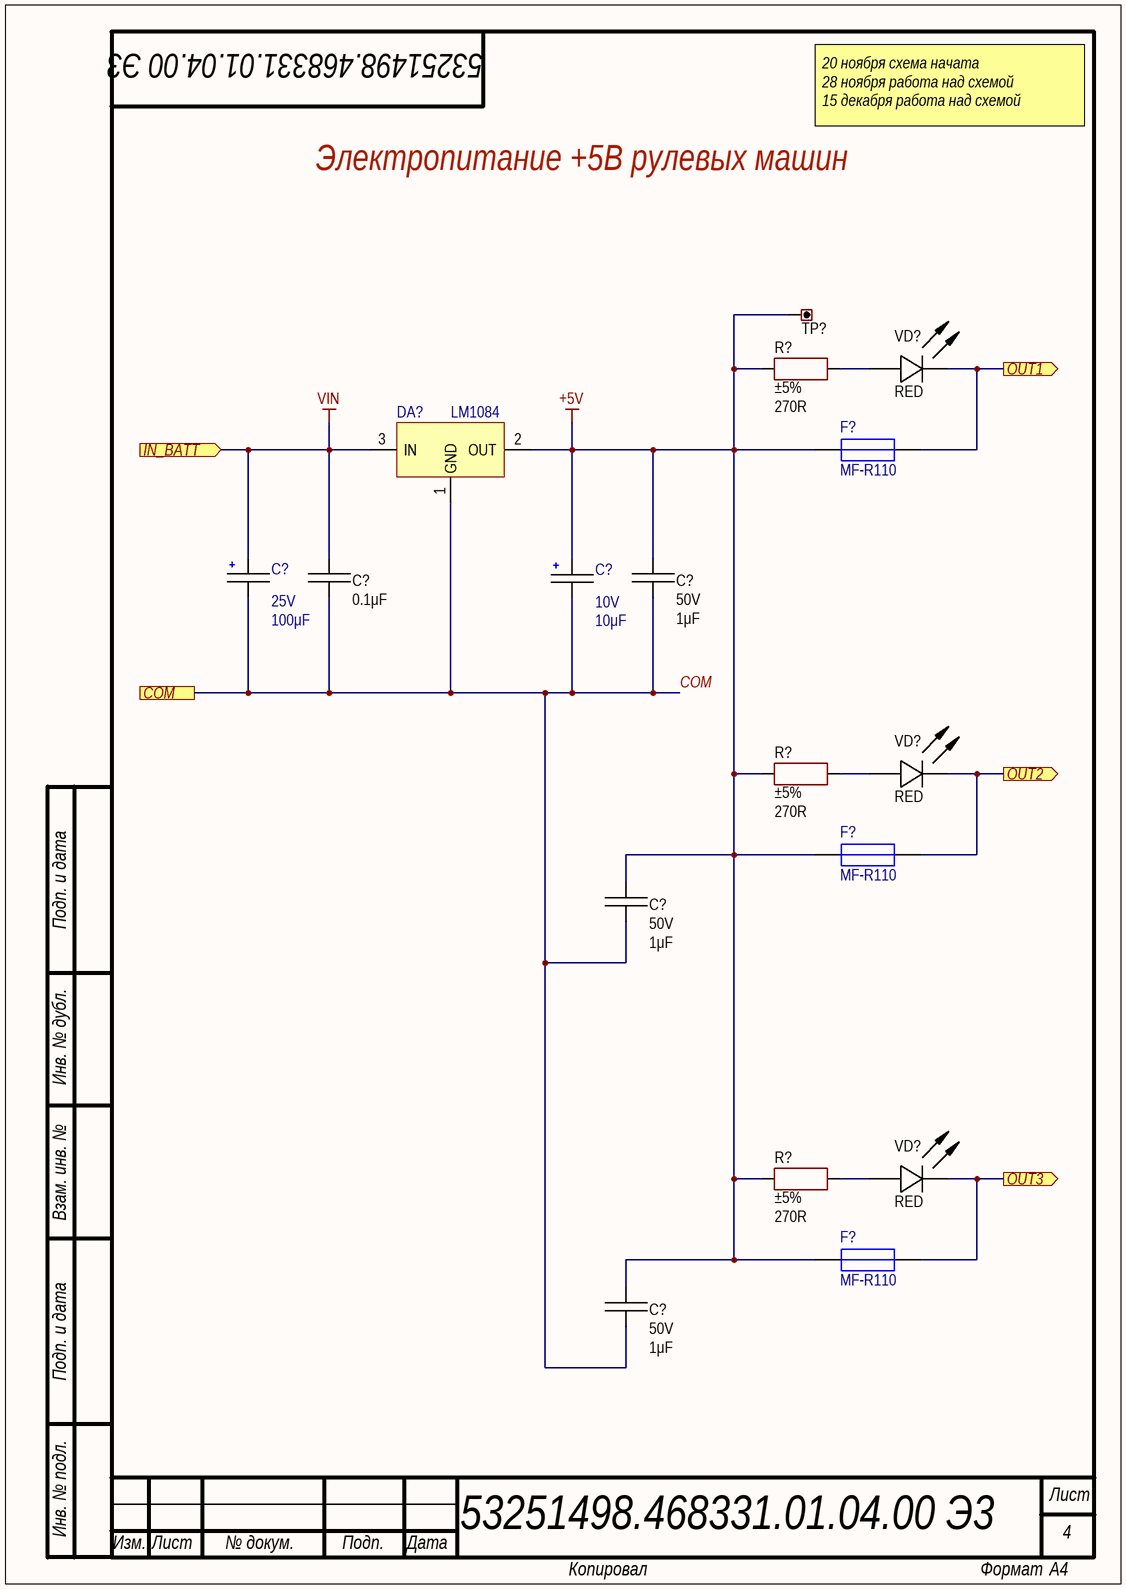
[diagram p3: PP_2_0_3.SchDoc]

### Parts
(Parts that share a designator on the sheet are numbered #1, #2 ... from top to bottom, then left to right.)
C?#1  value 100μF  Voltage: 25V  [CAP: RB2-5]  (hidden comment: Cap Pol1)
C?#2  value 0.1μF  [CAP: 0805, Thru-Hole]
C?#3  value 10μF  Voltage: 10V  [CAP: RB2-5]  (hidden comment: Cap Pol1)
C?#4  value 1μF  Voltage: 50V  [CAP: 1206, Thru-Hole]
C?#5  value 1μF  Voltage: 50V  [CAP: 1206, Thru-Hole]
C?#6  value 1μF  Voltage: 50V  [CAP: 1206, Thru-Hole]
DA?  7805  [TO-220_heatsink]  (value not drawn)
F?#1  MF-R110  [FUSE:MF-R_Style_1]
F?#2  MF-R110  [FUSE:MF-R_Style_1]
F?#3  MF-R110  [FUSE:MF-R_Style_1]
R?#1  value 270R  Tolerance: ±5%  [AXIAL-0.3]
R?#2  value 270R  Tolerance: ±5%  [AXIAL-0.3]
R?#3  value 270R  Tolerance: ±5%  [AXIAL-0.3]
TP?  (no value)  [CON: 5000 (Keystone)]
VD?#1  Color: RED  [LED: 3MM_301_R]
VD?#2  Color: RED  [LED: 3MM_301_R]
VD?#3  Color: RED  [LED: 3MM_301_R]

### Ports
COM, IN_BATT (in), OUT1 (out), OUT2 (out), OUT3 (out)

### Nets
+5V: C?#3.2 C?#4.2 C?#5.2 C?#6.2 DA?.2(OUT) F?#1.1 F?#2.1 F?#3.1 R?#1.1 R?#2.1 R?#3.1 TP?.1
VIN: C?#1.2 C?#2.2 DA?.3(IN) ; port IN_BATT
COM: C?#2.1 C?#3.1 C?#4.1 C?#5.1 C?#6.1 DA?.1(GND) ; port COM
OUT1: F?#1.2 VD?#1.2(C) ; port OUT1
OUT2: F?#2.2 VD?#2.2(C) ; port OUT2
OUT3: F?#3.2 VD?#3.2(C) ; port OUT3
NetR?#1_2: R?#1.2 VD?#1.1(A)
NetR?#2_2: R?#2.2 VD?#2.1(A)
NetR?#3_2: R?#3.2 VD?#3.1(A)

Not connected (* = marked no-connect by the designer): C?#1 1

### Channels
A?: designators C?=C?_A?#6 C?=C?_A?#8 C?=C?_A?#9 C?=C?_A?#7 C?=C?_A?#10 C?=C?_A?#11 DA?=DA?_A?#6 F?=F?_A?#2 F?=F?_A?#3 F?=F?_A?#4 R?=R?_A?#14 R?=R?_A?#15 R?=R?_A?#16 TP?=TP?_A?#5 VD?=VD?_A?#10 VD?=VD?_A?#11 VD?=VD?_A?#12; ports COM=COM IN_BATT=BAT OUT1=NetF?_A?#2_2 OUT2=NetF?_A?#3_2 OUT3=NetF?_A?#4_2
A?: designators C?=C?_A?#12 C?=C?_A?#14 C?=C?_A?#15 C?=C?_A?#13 C?=C?_A?#16 C?=C?_A?#17 DA?=DA?_A?#7 F?=F?_A?#5 F?=F?_A?#6 F?=F?_A?#7 R?=R?_A?#17 R?=R?_A?#18 R?=R?_A?#19 TP?=TP?_A?#6 VD?=VD?_A?#13 VD?=VD?_A?#14 VD?=VD?_A?#15; ports COM=COM IN_BATT=BAT OUT1=NetF?_A?#5_2 OUT2=NetF?_A?#6_2 OUT3=NetF?_A?#7_2

### Notes on the sheet
- 20 ноября схема начата
  28 ноября работа над схемой
  15 декабря работа над схемой
- Электропитание +5В рулевых машин
- Подп. и дата
- Инв. № дубл.
- Взам. инв. №
- Инв. № подл.
- Лист
- Изм.
- № докум.
- Подп.
- Дата
- Копировал
- Формат

### Library data of the parts
C?#1 C?#3 = Cap Pol1: Polarized Capacitor (Radial); Published: 8-Jun-2000; LatestRevisionDate: 17-Jul-2002; LatestRevisionNote: Re-released for DXP Platform.; PackageReference: RB2-5; Publisher: Altium Limited; PackageDescription: Polarized Capacitor (Radial); 2 Leads
C?#2 = Ceramic_0805: as C?#1 on sheet PP_2_0_1; Package: 1206; HelpURL: https://www.chipdip.ru/product/rpee41h105m3; Temperature: -55...+125°C
C?#4-C?#6 = Ceramic_1206: as C?#5 on sheet PP_2_0_2; Package: 1206; HelpURL: https://www.chipdip.ru/product/rpee41h105m3; Temperature: -55...+125°C
DA? = LM1084: as DA?#1 on sheet PP_2_0_2; Published: 15-Apr-2002; DatasheetVersion: Feb-1988; PackageVersion: Sep-1995; PackageReference: KC03; Publisher: Altium Limited; PackageDescription: TO220, Thru-Hole, Vertical, Heatsink Mounted; 3 In-Line Leads; Pitch 2.54 mm; ComponentLink1Description: Manufacturer Link; ComponentLink1URL: http://www.ti.com/; Type: LM1084
F?#1-F?#3 = Fuse 1A: MF-R110, 1.1 А, Предохранитель самовосстанавливающийся, MultiFuse; Value: 1A; Published: 8-Jun-2000; LatestRevisionDate: 17-Jul-2002; LatestRevisionNote: Re-released for DXP Platform.; PackageReference: MF-R_Style_2; Publisher: Altium Limited; PackageDescription: Thru-Hole; 2 Leads
R?#1-R?#3 = ResistorCF-25: as R?#1 on sheet PP_2_0_2; Package: CF-25; HelpURL: https://www.digikey.com/product-detail/en/yageo/RC0201JR-07100RL/311-100NCT-ND/1949006; Temperature: -55...+125°C
TP? = Connector_Test_Point: as TP?#1 on sheet PP_2_0; HelpURL: https://www.digikey.com/product-detail/en/keystone-electronics/5001/36-5001-ND/255327
VD?#1-VD?#3 = LED_single: as VD?#1 on sheet PP_2_0_1; Manufacturer: *; Package: *; HelpURL: *; Temperature: -55...+150°C; Current: *; VoltageDrop: *; ColorParameter: RED

## Sheet PP_2_0_4.SchDoc
size 209 x 297 mm; PageSetup: Record=PageOptions|CenterHorizontal=True|CenterVertical=True|PrintScale=0.94|XCorrection=1.00|YCorrection=1.00|PrintKind=2|BorderSize=5000000|LeftOffset=0|BottomOffset=0|Orientation=1|PaperLength=2970|PaperWidth=2100|Scale=100|PaperSource=7|PrintQuality=600|MediaType=1|DitherType=10|PaperKind=A4|PrintScaleMode=1; Title1str: (вторая строка при необходимости); DocumentType: Тип схемы; DocumentNumber: 53251498.468331.01.04.00 Э3; SheetNumber: 5; Format: A4
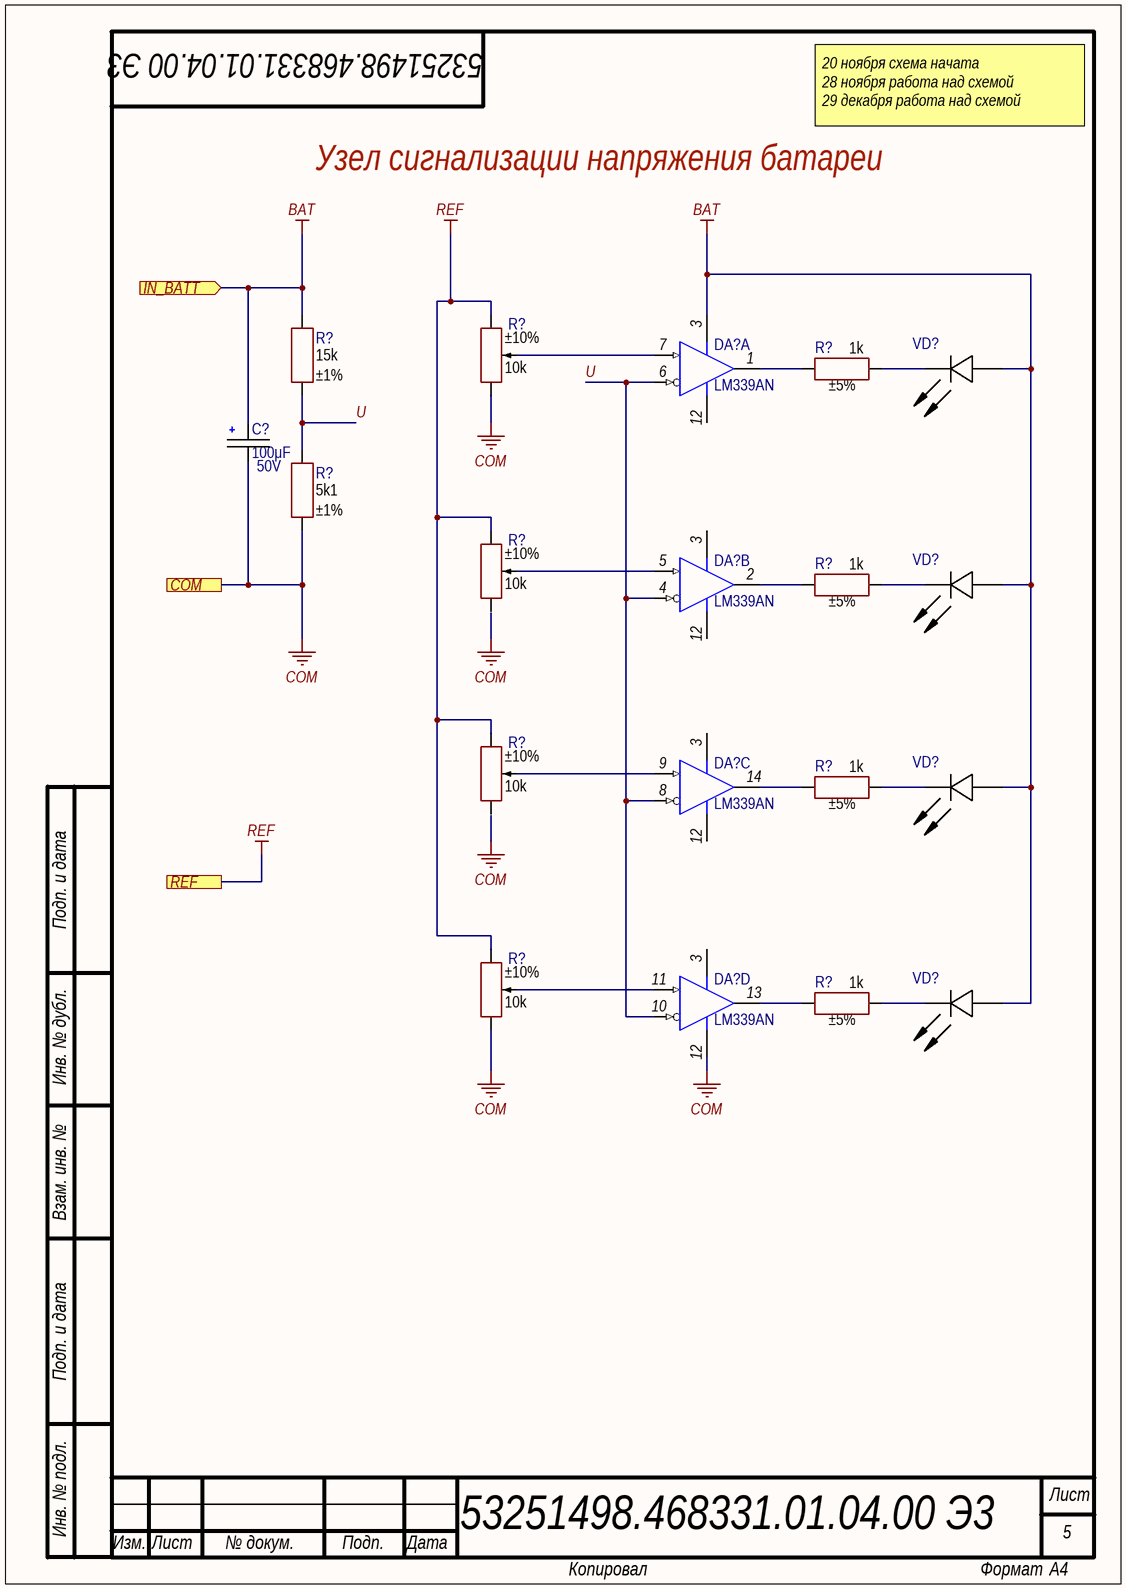
[diagram p4: PP_2_0_4.SchDoc]

### Parts
(Parts that share a designator on the sheet are numbered #1, #2 ... from top to bottom, then left to right.)
C?#8  value 100μF  Voltage: 50V  [CAP: RB2-5]  (hidden comment: Cap Pol1)
DA?#2  LM339AN  [N014]  (part A of 4)
DA?#3  LM339AN  [N014]  (part B of 4)
DA?#4  LM339AN  [N014]  (part C of 4)
DA?#5  LM339AN  [N014]  (part D of 4)
R?#3  value 10k  Tolerance: ±10%  [RES: 3296W]
R?#4  value 1k  Tolerance: ±5%  [RES:CF-1/4W]
R?#5  value 15k  Tolerance: ±1%  [RES:CF-1/4W]
R?#6  value 5k1  Tolerance: ±1%  [RES:CF-1/4W]
R?#7  value 10k  Tolerance: ±10%  [RES: 3296W]
R?#8  value 1k  Tolerance: ±5%  [RES:CF-1/4W]
R?#9  value 10k  Tolerance: ±10%  [RES: 3296W]
R?#10  value 1k  Tolerance: ±5%  [RES:CF-1/4W]
R?#11  value 10k  Tolerance: ±10%  [RES: 3296W]
R?#12  value 1k  Tolerance: ±5%  [RES:CF-1/4W]
VD?#4  (no value)  [LED: 3MM_301_G]
VD?#5  (no value)  [LED: 3MM_301_G]
VD?#6  (no value)  [LED: 3MM_301_G]
VD?#7  (no value)  [LED: 3MM_301_G]

### Ports
COM, IN_BATT (in), REF

### Nets
BAT: C?#8.2 DA?#2.3(VCC) R?#5.2 VD?#4.1(A) VD?#5.1(A) VD?#6.1(A) VD?#7.1(A) ; port IN_BATT
COM: C?#8.1 DA?#5.12(GND) R?#3.3 R?#6.1 R?#11.3 ; port COM
REF: R?#3.1 R?#7.1 R?#9.1 R?#11.1 ; port REF
U: DA?#2.6(IN-) DA?#3.4(IN-) DA?#4.8(IN-) DA?#5.10(IN-) R?#5.1 R?#6.2
NetDA?#2_1: DA?#2.1(OUT) R?#4.1
NetDA?#2_7: DA?#2.7(IN+) R?#3.2
NetDA?#3_2: DA?#3.2(OUT) R?#8.1
NetDA?#3_5: DA?#3.5(IN+) R?#7.2
NetDA?#4_9: DA?#4.9(IN+) R?#9.2
NetDA?#4_14: DA?#4.14(OUT) R?#10.1
NetDA?#5_11: DA?#5.11(IN+) R?#11.2
NetDA?#5_13: DA?#5.13(OUT) R?#12.1
NetR?#4_2: R?#4.2 VD?#4.2(C)
NetR?#8_2: R?#8.2 VD?#5.2(C)
NetR?#10_2: R?#10.2 VD?#6.2(C)
NetR?#12_2: R?#12.2 VD?#7.2(C)

Not connected (* = marked no-connect by the designer): DA?#2 12(GND); DA?#3 3(VCC) 12(GND); DA?#4 3(VCC) 12(GND); DA?#5 3(VCC); R?#7 3; R?#9 3

### Notes on the sheet
- 20 ноября схема начата
  28 ноября работа над схемой
  29 декабря работа над схемой
- Узел сигнализации напряжения батареи
- Подп. и дата
- Инв. № дубл.
- Взам. инв. №
- Инв. № подл.
- Лист
- Изм.
- № докум.
- Подп.
- Дата
- Копировал
- Формат

### Library data of the parts
C?#8 = Cap Pol1: Polarized Capacitor (Radial); Partnumber: JRB1E101M02500630110000B; Pitch: 2.5mm; Published: 8-Jun-2000; LatestRevisionDate: 17-Jul-2002; LatestRevisionNote: Re-released for DXP Platform.; PackageReference: RB2-5; Publisher: Altium Limited; PackageDescription: Polarized Capacitor (Radial); 2 Leads
DA?#2-DA?#5 = LM339AN: Quad Differential Comparator; Published: 15-Apr-2002; LatestRevisionDate: 04-Mar-2005; LatestRevisionNote: Stylized 3D Model Added.; DatasheetVersion: Apr-1988; PackageVersion: Oct-1995; PackageReference: N014; Publisher: Altium Limited; PackageDescription: DIP; 14 Leads; Row Spacing 7.62 mm; Pitch 2.54 mm; ComponentLink1Description: Manufacturer Link; ComponentLink1URL: http://www.ti.com/; ComponentLink2Description: Datasheet; ComponentLink2URL: http://www-s.ti.com/sc/ds/lm139a.pdf
R?#3 R?#7 R?#9 R?#11 = Trimmer: Manufacturer: Bourns; PartNumber: 3296W-1-103LF; ValueManufacturerPartNumber: Resistor film, 10k, ±10%, 3296W, 0.5W, -55...+125°C; TypeResistor: Resistor film; Power: 0.5W; Package: 3296W; HelpURL: https://www.digikey.com/product-detail/en/bourns-inc/3296W-1-103LF/3296W-103LF-ND/1088045; Temperature: -55...+125°C
R?#4 R?#8 R?#10 R?#12 = Resistor_CF-25: Manufacturer: Yageo; PartNumber: CF-1/4W-1KJ; ValueManufacturerPartNumber: Resistor film, 1k, ±5%, CF-25, 0.25W, -55...+125°C; TypeResistor: Resistor film; Power: 0.25W; Package: CF-25; HelpURL: https://www.chipdip.ru/product0/44435; Temperature: -55...+125°C
R?#5 = Resistor_CF-25: MF-25 (С2-23) 0.25 Вт, 15 кОм, 1%, Резистор металлопленочный; Manufacturer: Yageo; PartNumber: MF-1/4W-15KF; ValueManufacturerPartNumber: Resistor film, 15k, ±1%, MF-25, 0.25W, -55...+125°C; TypeResistor: Resistor film; Power: 0.25W; Package: MF-25; HelpURL: https://www.digikey.com/product-detail/en/yageo/RC0201JR-07100RL/311-100NCT-ND/1949006; Temperature: -55...+125°C
R?#6 = Resistor_CF-25: MF-25 (С2-23) 0.25 Вт, 5.1 кОм, 1%, Резистор металлопленочный; Manufacturer: Yageo; PartNumber: MF-1/4W-5K1F; ValueManufacturerPartNumber: Resistor film, 5k1, ±1%, MF-25, 0.25W, -55...+125°C; TypeResistor: Resistor film; Power: 0.25W; Package: MF-25; HelpURL: https://www.chipdip.ru/product0/29916; Temperature: -55...+125°C
VD?#4-VD?#7 = LED_single: ValueManufacturerPartNumber: LED, Green, *, *, *, -55...+150°C; TypeDiode: LED; ColorParameter: Green; Manufacturer: *; Package: *; HelpURL: *; Temperature: -55...+150°C; Current: *; VoltageDrop: *; PartNumber: *; Color: GREEN

## Sheet PP_2_0_5.SchDoc: Название платы
size 209 x 297 mm; ApprovedBy: Рогов; CheckedBy: Фамилия проверяющего; DrawnBy: Фамилия разработчика; DocumentNumber: Введите номер платы + Э3; SheetNumber: 6; SheetTotal: количество листов; PageSetup: Record=PageOptions|CenterHorizontal=True|CenterVertical=True|PrintScale=0.94|XCorrection=1.00|YCorrection=1.00|PrintKind=2|BorderSize=5000000|LeftOffset=0|BottomOffset=0|Orientation=1|PaperLength=2970|PaperWidth=2100|Scale=100|PaperSource=7|PrintQuality=600|MediaType=1|DitherType=10|PaperKind=A4|PrintScaleMode=1; Title1str: (вторая строка при необходимости); DocumentType: Тип схемы; Format: A4; ImagePath: Введите номер платы

### Notes on the sheet
- Подп. и дата
- Инв. № дубл.
- Взам. инв. №
- Инв. № подл.
- Лист
- Изм.
- № докум.
- Подп.
- Дата
- Копировал
- Формат

## Nets that join several sheets
+5V: PP_2_0 (TP?#1.1 X?#14.1 XT?#8.2 XT?#9.2), A? (6 pins), PP_2_0_2 (F?.2 VD?#1.2 VD?#2.2), A? (6 pins), A? (6 pins)
BAT: PP_2_0 (C?#1.2 X?#3.1 XT?#3.1), A? (DA?_A?#4.4 F?_A?#1.1 R?_A?#1.1), PP_2_0_2 (C?#2.2 C?#3.2 DA?#1.3), A? (C?_A?#6.2 C?_A?#7.2 DA?_A?#6.3), PP_2_0_4 (7 pins), A? (C?_A?#12.2 C?_A?#13.2 DA?_A?#7.3), A? (DA?_A?#11.4 F?_A?#8.1 R?_A?#20.1), A? (DA?_A?#16.4 F?_A?#9.1 R?_A?#33.1)
COM: PP_2_0 (31 pins), A? (16 pins), PP_2_0_2 (8 pins), A? (6 pins), PP_2_0_4 (5 pins), A? (6 pins), A? (16 pins), A? (16 pins)
REF: PP_2_0_2 (5 pins), PP_2_0_4 (R?#3.1 R?#7.1 R?#9.1 R?#11.1)
NetDA?_A?#1_3: PP_2_0 (X?#1.5), A? (DA?_A?#1.3 R?_A?#2.1)
NetDA?_A?#1_5: PP_2_0 (X?#1.1), A? (DA?_A?#1.5)
NetDA?_A?#1_7: PP_2_0 (X?#1.3), A? (DA?_A?#1.7)
NetDA?_A?#2_10: PP_2_0 (X?#1.2), A? (DA?_A?#2.10)
NetDA?_A?#2_11: PP_2_0 (X?#1.6), A? (DA?_A?#2.11 R?_A?#3.1)
NetDA?_A?#2_12: PP_2_0 (X?#1.4), A? (DA?_A?#2.12)
NetDA?_A?#8_3: PP_2_0 (X?#7.5), A? (DA?_A?#8.3 R?_A?#21.1)
NetDA?_A?#8_5: PP_2_0 (X?#7.1), A? (DA?_A?#8.5)
NetDA?_A?#8_7: PP_2_0 (X?#7.3), A? (DA?_A?#8.7)
NetDA?_A?#9_10: PP_2_0 (X?#7.2), A? (DA?_A?#9.10)
NetDA?_A?#9_11: PP_2_0 (X?#7.6), A? (DA?_A?#9.11 R?_A?#22.1)
NetDA?_A?#9_12: PP_2_0 (X?#7.4), A? (DA?_A?#9.12)
NetDA?_A?#13_3: PP_2_0 (X?#11.5), A? (DA?_A?#13.3 R?_A?#34.1)
NetDA?_A?#13_5: PP_2_0 (X?#11.1), A? (DA?_A?#13.5)
NetDA?_A?#13_7: PP_2_0 (X?#11.3), A? (DA?_A?#13.7)
NetDA?_A?#14_10: PP_2_0 (X?#11.2), A? (DA?_A?#14.10)
NetDA?_A?#14_11: PP_2_0 (X?#11.6), A? (DA?_A?#14.11 R?_A?#35.1)
NetDA?_A?#14_12: PP_2_0 (X?#11.4), A? (DA?_A?#14.12)
NetF?_A?#2_2: PP_2_0 (X?#2.4), A? (F?_A?#2.2 VD?_A?#10.2)
NetF?_A?#3_2: PP_2_0 (X?#5.4), A? (F?_A?#3.2 VD?_A?#11.2)
NetF?_A?#4_2: PP_2_0 (X?#6.4), A? (F?_A?#4.2 VD?_A?#12.2)
NetF?_A?#5_2: PP_2_0 (X?#9.4), A? (F?_A?#5.2 VD?_A?#13.2)
NetF?_A?#6_2: PP_2_0 (X?#10.4), A? (F?_A?#6.2 VD?_A?#14.2)
NetF?_A?#7_2: PP_2_0 (X?#12.4), A? (F?_A?#7.2 VD?_A?#15.2)
OUT1: PP_2_0 (XT?#1.1), A? (DA?_A?#1.2 VD?_A?#2.1 VD?_A?#6.2)
OUT1: PP_2_0 (XT?#4.1), A? (DA?_A?#8.2 VD?_A?#17.1 VD?_A?#21.2)
OUT1: PP_2_0 (XT?#6.1), A? (DA?_A?#13.2 VD?_A?#26.1 VD?_A?#30.2)
OUT2: PP_2_0 (XT?#1.2), A? (DA?_A?#1.3 VD?_A?#3.1 VD?_A?#7.2)
OUT2: PP_2_0 (XT?#4.2), A? (DA?_A?#8.3 VD?_A?#18.1 VD?_A?#22.2)
OUT2: PP_2_0 (XT?#6.2), A? (DA?_A?#13.3 VD?_A?#27.1 VD?_A?#31.2)
OUT3: PP_2_0 (XT?#2.1), A? (DA?_A?#2.13 VD?_A?#4.1 VD?_A?#8.2)
OUT3: PP_2_0 (XT?#5.1), A? (DA?_A?#9.13 VD?_A?#19.1 VD?_A?#23.2)
OUT3: PP_2_0 (XT?#7.1), A? (DA?_A?#14.13 VD?_A?#28.1 VD?_A?#32.2)
OUT4: PP_2_0 (XT?#2.2), A? (DA?_A?#2.14 VD?_A?#5.1 VD?_A?#9.2)
OUT4: PP_2_0 (XT?#5.2), A? (DA?_A?#9.14 VD?_A?#20.1 VD?_A?#24.2)
OUT4: PP_2_0 (XT?#7.2), A? (DA?_A?#14.14 VD?_A?#29.1 VD?_A?#33.2)
OutCurrentA: PP_2_0 (X?#4.1), A? (DA?_A?#3.1 R?_A?#7.2 R?_A?#7.3 TP?_A?#3.1)
OutCurrentA: PP_2_0 (X?#8.1), A? (DA?_A?#10.1 R?_A?#26.2 R?_A?#26.3 TP?_A?#9.1)
OutCurrentA: PP_2_0 (X?#13.1), A? (DA?_A?#15.1 R?_A?#39.2 R?_A?#39.3 TP?_A?#13.1)
OutCurrentB: PP_2_0 (X?#4.5), A? (DA?_A?#5.7 R?_A?#11.2 R?_A?#11.3 TP?_A?#4.1)
OutCurrentB: PP_2_0 (X?#8.5), A? (DA?_A?#12.7 R?_A?#30.2 R?_A?#30.3 TP?_A?#10.1)
OutCurrentB: PP_2_0 (X?#13.5), A? (DA?_A?#17.7 R?_A?#43.2 R?_A?#43.3 TP?_A?#14.1)